# EAGLE design SparkFun_MIDI_Shield (EAGLE 7.3.0)
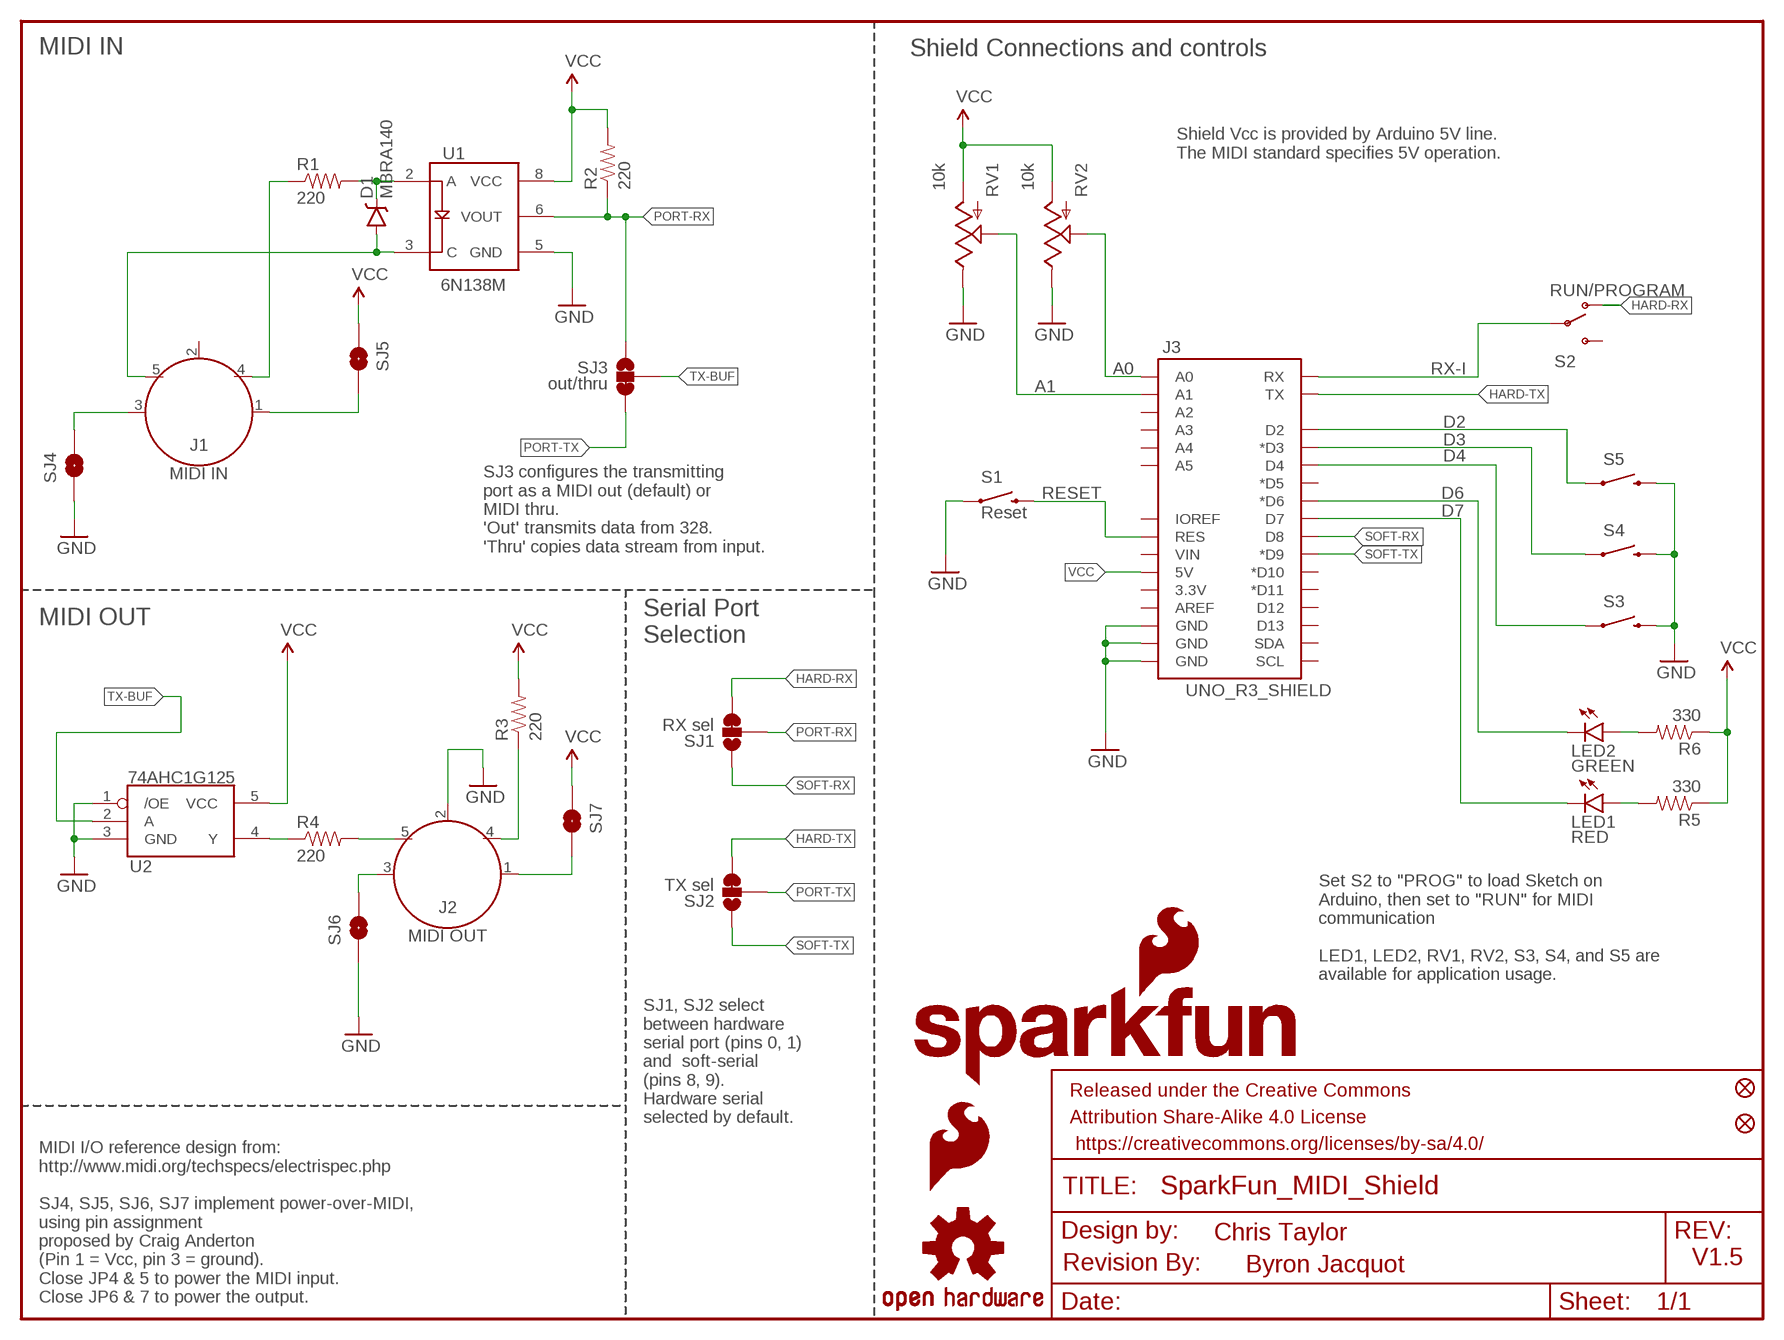
[diagram p0: schematic, sheet 1]

## Parts
D1  MBRA140  [SMA-DIODE]
FID1  FIDUCIALUFIDUCIAL  [MICRO-FIDUCIAL]
FID2  FIDUCIALUFIDUCIAL  [MICRO-FIDUCIAL]
FRAME1  Frame  FRAME-LETTER  [CREATIVE_COMMONS]
J1  MIDI IN  5-PIN-CIRCULAR-DINNEW  [5-PIN-DIN-RA-PCB-NEW]
J2  MIDI OUT  5-PIN-CIRCULAR-DINNEW  [5-PIN-DIN-RA-PCB-NEW]
J3  UNO_R3_SHIELD  ARDUINO_R3_SHIELD  [UNO_R3_SHIELD]
LED1  RED  LED-RED0603  [LED-0603]
LED2  GREEN  LED-GREEN0603  [LED-0603]
LOGO1  SFE_LOGO_NAME_FLAME.2_INCH  [SFE_LOGO_NAME_FLAME_.2]
LOGO2  OSHW-LOGOS  [OSHW-LOGO-S]
LOGO3  OSHW-LOGOM  [OSHW-LOGO-M]
LOGO5  SFE_LOGO_FLAME.1_INCH  [SFE_LOGO_FLAME_.1]
R1  220  220OHM-1/10W-1%(0603)  [0603-RES]
R2  220  220OHM-1/10W-1%(0603)  [0603-RES]
R3  220  220OHM-1/10W-1%(0603)  [0603-RES]
R4  220  220OHM-1/10W-1%(0603)  [0603-RES]
R5  330  330OHM1/10W1%(0603)  [0603-RES]
R6  330  330OHM1/10W1%(0603)  [0603-RES]
RV1  10k  POT  [ALPS_POT]
RV2  10k  POT  [ALPS_POT]
S1  Reset  SWITCH-MOMENTARY-2SMD  [TACTILE-SWITCH-SMD]
S2  RUN/PROGRAM  SWITCH-SPDTSMD  [AYZ0202]
S3  SWITCH-MOMENTARY-212MM  [TACTILE-PTH-12MM]
S4  SWITCH-MOMENTARY-212MM  [TACTILE-PTH-12MM]
S5  SWITCH-MOMENTARY-212MM  [TACTILE-PTH-12MM]
SJ1  RX sel  JUMPER-PAD-3-2OF3_NC_BY_TRACE_SMALL  [PAD-JUMPER-3-2OF3_NC_BY_TRACE_YES_SILK_FULL_BOX]
SJ2  TX sel  JUMPER-PAD-3-2OF3_NC_BY_TRACE_SMALL  [PAD-JUMPER-3-2OF3_NC_BY_TRACE_YES_SILK_FULL_BOX]
SJ3  out/thru  JUMPER-PAD-3-2OF3_NC_BY_TRACE_SMALL  [PAD-JUMPER-3-2OF3_NC_BY_TRACE_YES_SILK_FULL_BOX]
SJ4  JUMPER-PAD-2-NOYES_SILK  [PAD-JUMPER-2-NO_YES_SILK]
SJ5  JUMPER-PAD-2-NOYES_SILK  [PAD-JUMPER-2-NO_YES_SILK]
SJ6  JUMPER-PAD-2-NOYES_SILK  [PAD-JUMPER-2-NO_YES_SILK]
SJ7  JUMPER-PAD-2-NOYES_SILK  [PAD-JUMPER-2-NO_YES_SILK]
U1  6N138M  OPTO_DARL_6N138S  [8-SMD]
U2  74AHC1G125  [SOT23-5]
U$1  REVISION  [REVISION]

## Nets
56: D1.C R1.2 U1.2(A)
1235: J2.4 R3.1
A0: J3.A0 RV2.P$2(S)
A1: J3.A1 RV1.P$2(S)
D2: J3.D2 S5.1
D3: J3.D3(*D3) S4.1
D4: J3.D4 S3.1
D6: J3.D6(*D6) LED2.C
D7: J3.D7 LED1.C
GND: J2.2 J3.GND@0(GND) J3.GND@1(GND) J3.GND@2(GND) RV1.P$1(E) RV2.P$1(E) S1.1 S3.3 S4.3 S5.3 SJ4.1 SJ6.1 U1.5(GND) U2.1(/OE) U2.3(GND)
HARD-RX: S2.1(O) SJ1.3
HARD-TX: J3.TX SJ2.3
N$1: J2.5 R4.2
N$2: J1.4 R1.1
N$3: R4.1 U2.4(Y)
N$4: J2.3 SJ6.2
N$5: J2.1 SJ7.2
N$6: J1.3 SJ4.2
N$7: J1.1 SJ5.2
N$9: LED1.A R5.2
N$10: LED2.A R6.2
PIN5: D1.A J1.5 U1.3(C)
PORT-RX: R2.1 SJ1.2 SJ3.1 U1.6(VOUT)
PORT-TX: SJ2.2 SJ3.3
RESET: J3.RES S1.3
RX-I: J3.RX S2.2(P)
SOFT-RX: J3.D8 SJ1.1
SOFT-TX: J3.D9(*D9) SJ2.1
TX-BUF: SJ3.2 U2.2(A)
VCC: J3.5V R2.2 R3.2 R5.1 R6.1 RV1.P$3(A) RV2.P$3(A) SJ5.1 SJ7.1 U1.8(VCC) U2.5(VCC)
Unconnected: J1.2 J3.3.3V J3.A2 J3.A3 J3.A4 J3.A5 J3.AREF J3.D5(*D5) J3.D10(*D10) J3.D11(*D11) J3.D12 J3.D13 J3.IOREF J3.SCL J3.SDA J3.VIN S2.3(S)

## Notes on the sheet
- MIDI IN | Shield Connections and controls
- Shield Vcc is provided by Arduino 5V line.  
  The MIDI standard specifies 5V operation.
- SJ3 configures the transmitting
  port as a MIDI out (default) or 
  MIDI thru.
  'Out' transmits data from 328.
  'Thru' copies data stream from input.
- MIDI OUT
- Serial Port
  Selection
- Set S2 to "PROG" to load Sketch on 
  Arduino, then set to "RUN" for MIDI 
  communication
  
  LED1, LED2, RV1, RV2, S3, S4, and S5 are 
  available for application usage.
- SJ1, SJ2 select 
  between hardware 
  serial port (pins 0, 1) 
  and  soft-serial 
  (pins 8, 9).  
  Hardware serial 
  selected by default.
- MIDI I/O reference design from:
  http://www.midi.org/techspecs/electrispec.php
  
  SJ4, SJ5, SJ6, SJ7 implement power-over-MIDI, 
  using pin assignment
  proposed by Craig Anderton 
  (Pin 1 = Vcc, pin 3 = ground).
  Close JP4 & 5 to power the MIDI input.
  Close JP6 & 7 to power the output.
- Chris Taylor
- V1.5
- Byron Jacquot

## Library data of the parts
D1 = SparkFun-DiscreteSemi:MBRA140: 40V, 1A Schottky rectifier SMA/DO-214AC package DIO-08053; PROD_ID: DIO-08053
FID1 FID2 = SparkFun-Aesthetics:FIDUCIAL: Fiducial Alignment Points Various fiducial points for machine vision alignment.
FRAME1 = SparkFun-Aesthetics:FRAME-LETTER: Schematic Frame Standard 8.5x11 US Letter frame
J1 J2 = Testing:5-PIN-CIRCULAR-DIN: 5-pin circular DIN connector. Fillsize variant is frequently used as a MIDI jack; PROD_ID: CONN-09481
J3 = SparkFun-Boards:ARDUINO_R3_SHIELD: Shield form compatible with the Arduino Uno R3.
LED1 = SparkFun-LED:LED-RED: Assorted Red LEDs LilyPad 1206- DIO-09912 1206- DIO-00809 0603- DIO-00819 "SMART" means more efficient and expensive; PROD_ID: DIO-00819
LED2 = SparkFun-LED:LED-GREEN: Various green LEDs Green LEDs used in SFE Production 0603- DIO-00821 LARGE- DIO-00862 LILYPAD- DIO-09910; PROD_ID: DIO-00821
LOGO1 = SparkFun-Aesthetics:SFE_LOGO_NAME_FLAME: SFE Logo, name and flame This is the SparkFun full logo. The logo on the schematic will always be the same size; the package variant is the height of the flame part of the logo. Default layer for the logo on the board is tSilk.
LOGO2 LOGO3 = SparkFun-Aesthetics:OSHW-LOGO: Open Source Hardware Logo This logo indicates the piece of hardware it is found on incorporates a OSHW license and/or adheres to the definition of open source hardware found here: http://freedomdefined.org/OSHW
LOGO5 = SparkFun-Aesthetics:SFE_LOGO_FLAME: SFE Logo, flame only This is the SparkFun flame logo. The logo on the schematic will always be the same size; the package variant is the height of the flame. Default layer for the logo on the board is tSilk.
R1-R4 = SparkFun-Resistors:220OHM-1/10W-1%(0603): RES-07861; PROD_ID: RES-07861
R5 R6 = SparkFun-Resistors:330OHM1/10W1%(0603): RES-00818; PROD_ID: RES-00818
RV1 RV2 = SparkFun-Electromechanical:POT; PROD_ID: RES-09177
S1 = SparkFun-Electromechanical:SWITCH-MOMENTARY-2: Various NO switches- pushbuttons, reed, etc; PROD_ID: SWCH-08247
S2 = SparkFun-Electromechanical:SWITCH-SPDT: SPDT Switch Simple slide switch, Spark Fun Electronics SKU : COM-00102 DPDT SMT slide switch, AYZ0202, SWCH-08179; PROD_ID: SWCH-08179
S3-S5 = SparkFun-Electromechanical:SWITCH-MOMENTARY-2: Various NO switches- pushbuttons, reed, etc; PROD_ID: SWCH-09185
SJ1-SJ3 = SparkFun-Passives:JUMPER-PAD-3-2OF3_NC_BY_TRACE
SJ4-SJ7 = SparkFun-Passives:JUMPER-PAD-2-NO
U1 = SparkFun-DiscreteSemi:OPTO_DARL_6N138S: Optoisolator, darlington pair output; PROD_ID: IC-09482
U2 = SparkFun-DigitalIC:74AHC1G125: Single bus buffer gate with 3-state output; PROD_ID: IC-11920
U$1 = SparkFun-Aesthetics:REVISION

## Board
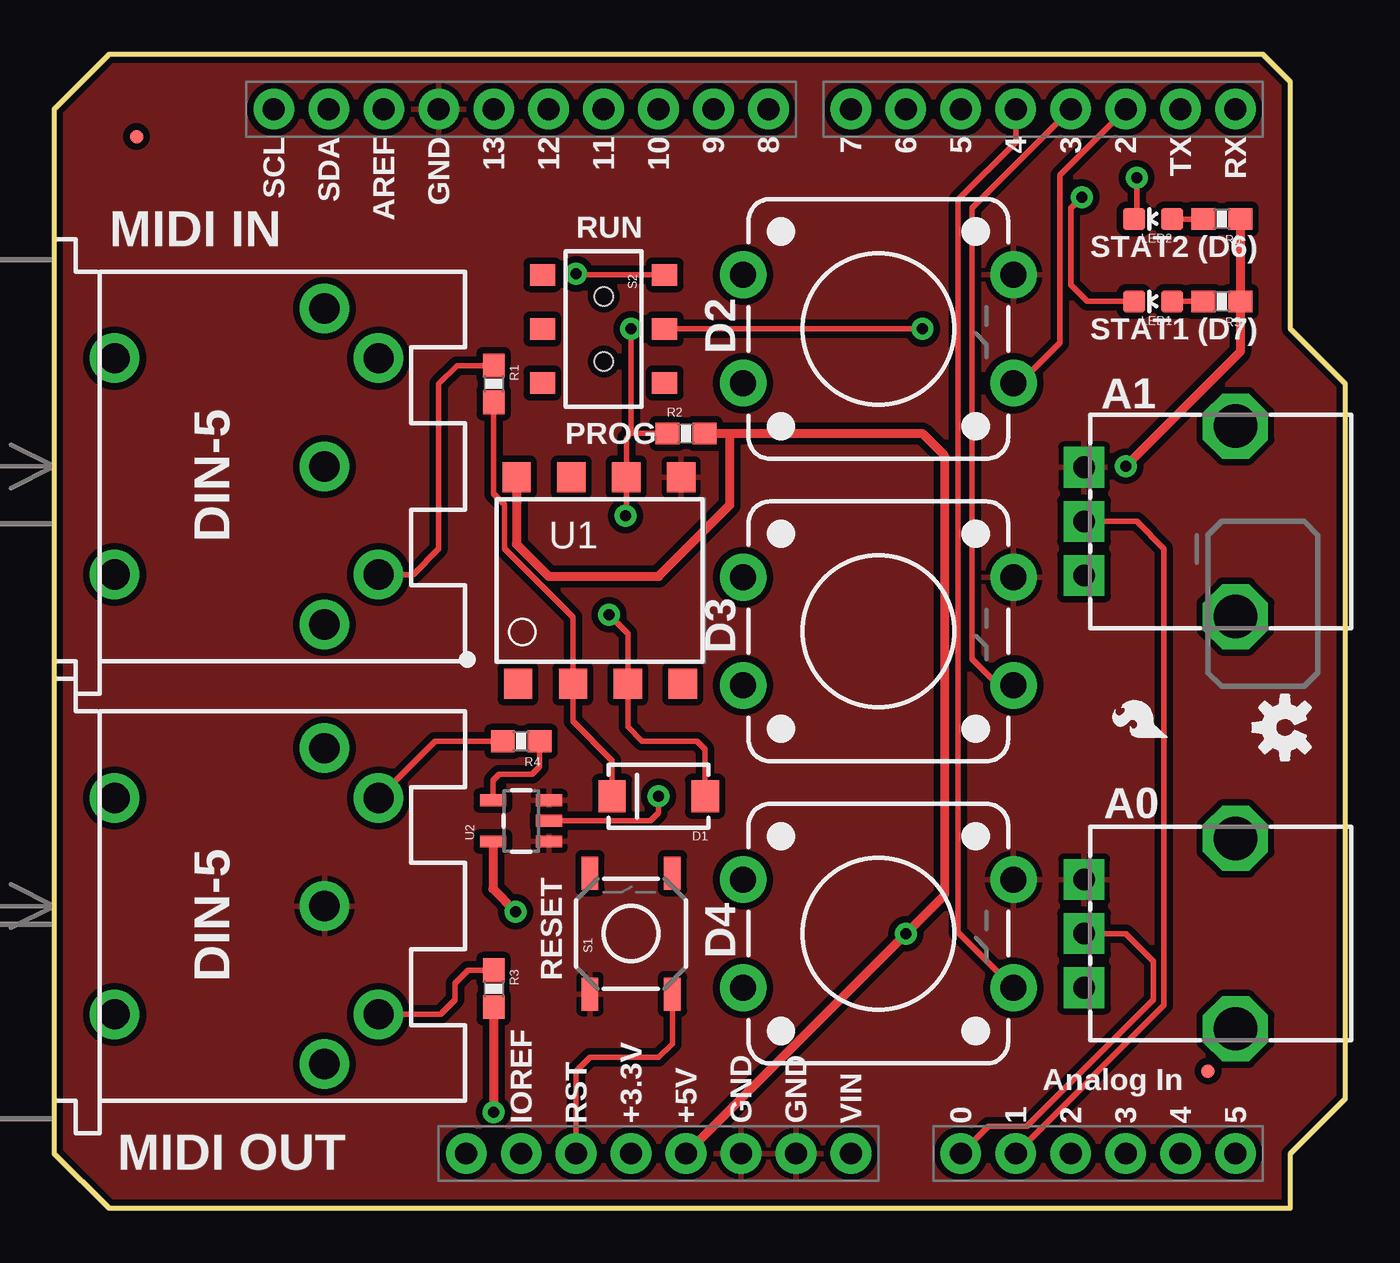
[diagram p1: board, top side]
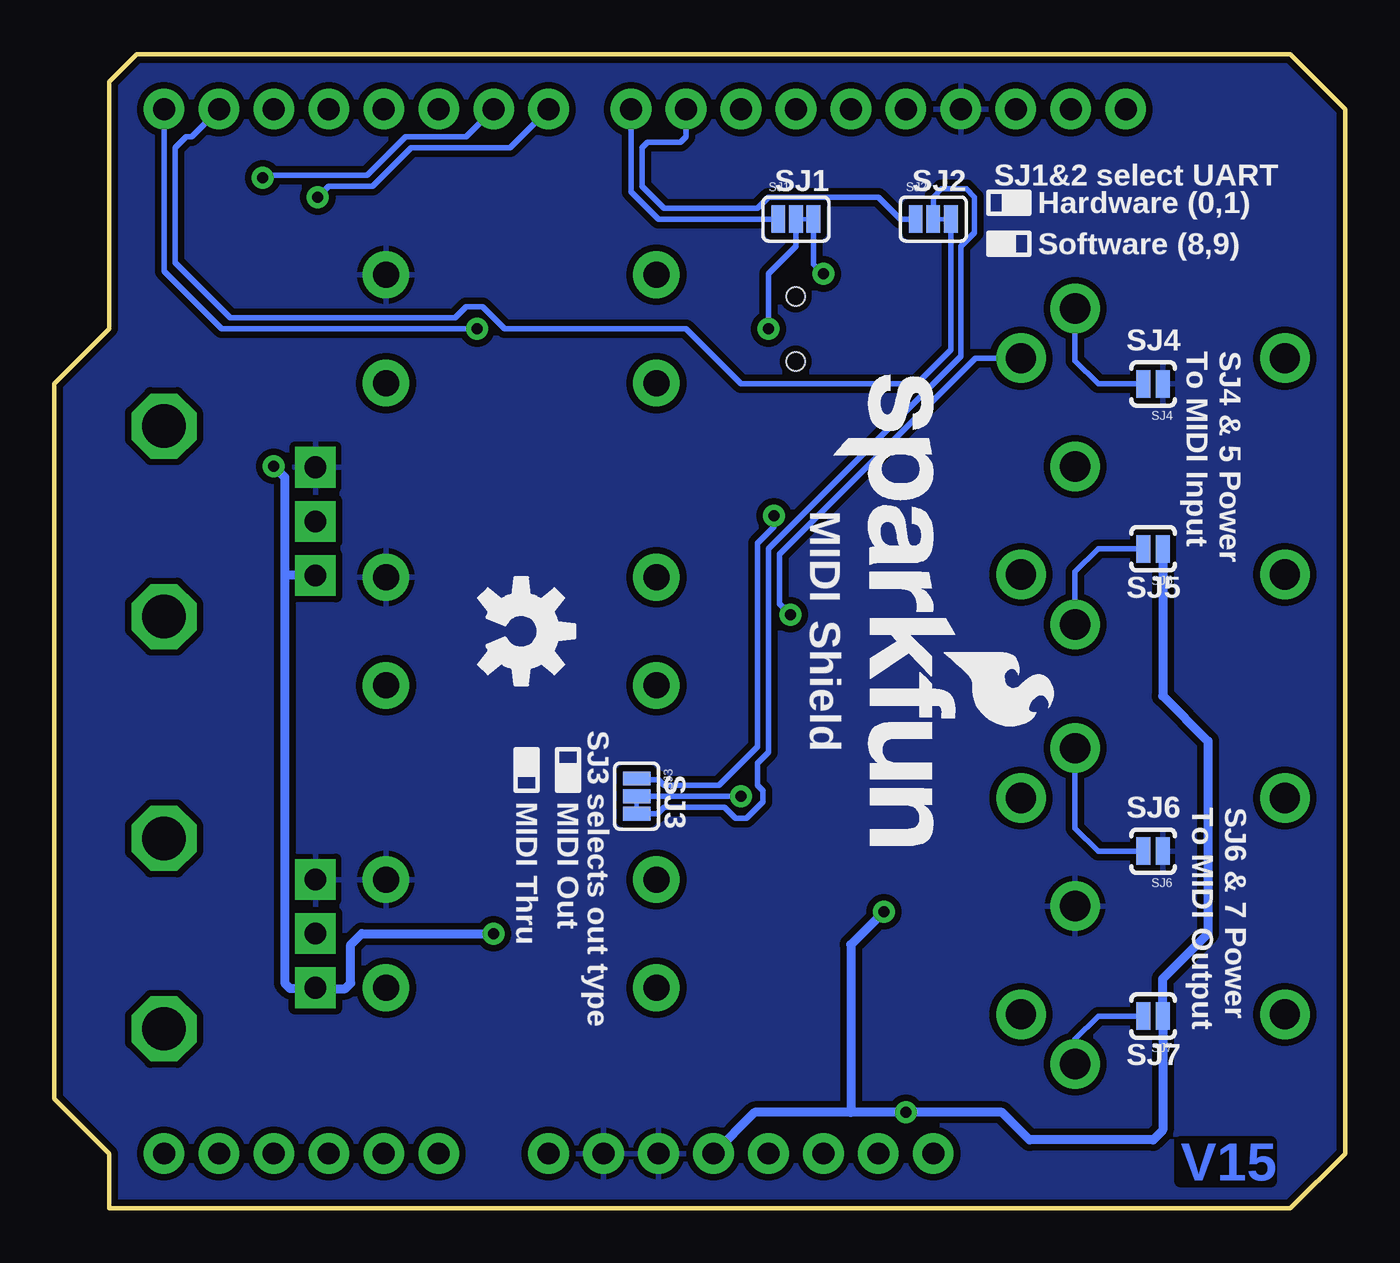
[diagram p2: board, bottom side, seen from below]

Size 59.69 x 53.34 mm. Coordinates in mm from the lower left corner, seen from the top.
Outline: 0,2.54 0,50.8 2.54,53.34 55.88,53.34 57.15,52.07 57.15,40.64 59.69,38.1 59.69,5.08 57.15,2.54 57.15,0 2.54,0 0,2.54
Copper layers (1+2*16): Top 0.035mm / dielectric 1.5mm / Route2 0.035mm / dielectric 0.15mm / Bottom 0.035mm
Design rules "SparkFun-2-layer *": minimum track width 7mil, minimum drill 15mil, track to track 8mil, track to pad 8mil, pad to pad 8mil, via to via 8mil, smd to smd 8mil, copper to edge 8mil, drill to drill 8mil, minimum pad ring 12mil, minimum via ring 10mil, stop-mask expansion 4mil, vias tented up to drill 20mil, thermal gap 10mil

### Footprints (pad centres in the part's own frame; a part is rotated, then mirrored left to right if it is on the bottom)
SMA-DIODE = smd 1.27 x 1.47: A -2.15,0; C 2.15,0
MICRO-FIDUCIAL = smd 0.635 x 0.635: 1 0,0
5-PIN-DIN-RA-PCB-NEW = drill 1.4 pad 2.286: 1 7.3,12.5; 2 0,12.5; 3 -7.3,12.5; 4 5,15; 5 -5,15; 6 -5,2.8; 7 5,2.8
UNO_R3_SHIELD = drill 1.016 pad 1.88: 3.3V 50.8,26.67; 5V 50.8,29.21; A0 50.8,41.91; A1 50.8,44.45; A2 50.8,46.99; A3 50.8,49.53; A4 50.8,52.07; A5 50.8,54.61; AREF 2.54,15.24; D2 2.54,49.53; D3 2.54,46.99; D4 2.54,44.45; D5 2.54,41.91; D6 2.54,39.37; D7 2.54,36.83; D8 2.54,33.02; D9 2.54,30.48; D10 2.54,27.94; D11 2.54,25.4; D12 2.54,22.86; D13 2.54,20.32; GND@0 50.8,31.75; GND@1 50.8,34.29; GND@2 2.54,17.78; IOREF 50.8,21.59; NC 50.8,19.05; RES 50.8,24.13; RX 2.54,54.61; SCL 2.54,10.16; SDA 2.54,12.7; TX 2.54,52.07; VIN 50.8,36.83
LED-0603 = smd 1 x 1: A 0,-0.877; C 0,0.877
0603-RES = smd 1.1 x 1: 1 -0.85,0; 2 0.85,0
ALPS_POT = drill 1 pad 1.88 square: P$1 7,-2.5; P$2 7,0; P$3 7,2.5 | drill 2 octagon: P$4 0,-4.4; P$5 0,4.4
TACTILE-SWITCH-SMD = smd 1.524 x 0.762: 1 -2.794,1.905; 2 2.794,1.905; 3 -2.794,-1.905; 4 2.794,-1.905
AYZ0202 = smd 1 x 1.15: 1 -2.5,2.825; 2 0,2.825; 3 2.5,2.825; 4 -2.5,-2.825; 5 0,-2.825; 6 2.5,-2.825 | hole 0.85: 1.5,0; -1.5,0
TACTILE-PTH-12MM = drill 1.2 pad 2.159: 1 6.25,-2.5; 2 -6.25,-2.5; 3 6.25,2.5; 4 -6.25,2.5
PAD-JUMPER-3-2OF3_NC_BY_TRACE_YES_SILK_FULL_BOX = smd 0.635 x 1.27: 1 -0.813,0; 2 0,0; 3 0.813,0
PAD-JUMPER-2-NO_YES_SILK = smd 0.635 x 1.27: 1 -0.45,0; 2 0.45,0
8-SMD = smd 1.3 x 1.4: 1 -3.96,-4.96; 2 -1.42,-4.96; 3 1.12,-4.96; 4 3.66,-4.96; 5 3.59,4.58; 6 1.05,4.58; 7 -1.49,4.58; 8 -4.03,4.58
SOT23-5 = smd 0.55 x 1.2: 1 -0.95,-1.3; 2 0,-1.3; 3 0.95,-1.3; 4 0.95,1.3; 5 -0.95,1.3

### Placement (x,y rotation side)
D1  27.94,19.05 180 top
FID1  53.34,6.35 0 top
FID2  3.81,49.53 0 top
FRAME1  -12.7,-13.97 0 top  (outside the outline)
J1  0,34.29 270 top
J2  0,13.97 270 top
J3  0,53.34 270 top
LED1  50.8,41.91 90 top
LED2  50.8,45.72 90 top
LOGO1  23.75,39.24 270 bottom
LOGO2  56.9,22.23 90 top
LOGO3  38.1,26.67 270 bottom
LOGO5  51.82,21.46 90 top
R1  20.32,38.1 270 top
R2  29.21,35.81 0 top
R3  20.32,10.16 270 top
R4  21.59,21.59 180 top
R5  53.98,41.91 180 top
R6  53.98,45.72 180 top
RV1  54.61,31.75 180 top
RV2  54.61,12.7 180 top
S1  26.67,12.7 90 top
S2  25.4,40.64 270 top
S3  38.1,12.7 0 top
S4  38.1,26.67 0 top
S5  38.1,40.64 0 top
SJ1  25.4,45.72 0 bottom
SJ2  19.05,45.72 0 bottom
SJ3  32.77,19.05 270 bottom
SJ4  8.89,38.1 180 bottom
SJ5  8.89,30.48 180 bottom
SJ6  8.89,16.51 180 bottom
SJ7  8.89,8.89 180 bottom
U1  25.4,29.21 0 top
U2  21.59,17.91 90 top
U$1  -1.27,-16.51 0 top  (outside the outline)

### Tracks (layer width: path | path; a pad name or v marks a point on that pad's centre or on a via)
56
  Top 0.254: D1.C 25.79,20.69 23.98,22.5 U1.2 23.98,27.33 20.83,30.48 20.83,32.51 20.32,33.02 R1.2
1235
  Top 0.254: J2.4 17.86,8.97 18.54,9.65 18.54,10.41 19.14,11.01 R3.1
A0
  Top 0.254: J3.A0 43.18,3.81 44.96,3.81 50.8,9.65 50.8,11.43 49.53,12.7 RV2.P$2
A1
  Top 0.254: J3.A1 51.31,9.4 51.31,30.48 50.04,31.75 RV1.P$2
D2
  Top 0.254: S5.1 44.62,38.14 46.48,40.01 46.48,47.75 J3.D2
D3
  Top 0.254: S4.1 43.65,24.17 42.42,25.4 42.42,46.23 J3.D3
D4
  Top 0.254: S3.1 41.78,12.77 41.78,46.61 44.45,49.28 J3.D4
D6  (via drill 0.51)
  Top 0.254: LED2.C 50.04,45.84 v50.04,47.62
  Bottom 0.254: J3.D6 40.64,49.53 43.43,49.53 45.21,47.75 50.04,47.75 v50.04,47.62
D7  (via drill 0.51)
  Top 0.254: v47.5,46.74 46.99,46.23 46.99,42.67 47.75,41.91 LED1.C
  Bottom 0.254: J3.D7 38.61,49.02 43.18,49.02 44.96,47.24 46.99,47.24 v47.5,46.74
GND
  pour Bottom (isolate 0.305): 0,50.8 2.54,53.34 55.88,53.34 57.15,52.07 57.15,40.64 59.69,38.1 59.69,5.08 57.15,2.54 57.15,0 2.54,0 0,2.54
  pour Top (isolate 0.305): 0,50.8 2.54,53.34 55.88,53.34 57.15,52.07 57.15,40.64 59.69,38.1 59.69,5.08 57.15,2.54 57.15,0 2.54,0 0,2.54
HARD-RX  (via drill 0.51)
  Top 0.254: S2.1 24.17,43.14 v24.13,43.18
  Bottom 0.254: SJ1.3 24.59,43.64 v24.13,43.18
HARD-TX
  Bottom 0.254: J3.TX 53.34,49.53 53.59,49.53 54.1,49.02 54.1,43.69 51.56,41.15 41.15,41.15 40.64,41.66 39.88,41.66 38.86,40.64 30.48,40.64 27.94,38.1 19.81,38.1 18.24,39.67 SJ2.3
N$1
  Top 0.254: R4.2 17.62,21.59 J2.5
N$2
  Top 0.254: J1.4 16.59,29.29 17.78,30.48 17.78,38.1 18.63,38.95 R1.1
N$3
  Top 0.254: U2.4 20.29,19.78 20.57,20.07 22.1,20.07 22.44,20.41 R4.1
N$4
  Bottom 0.254: SJ6.2 11.43,16.51 12.5,17.58 J2.3
N$5
  Bottom 0.254: SJ7.2 11.43,8.89 12.5,7.82 J2.1
N$6
  Bottom 0.254: SJ4.2 11.43,38.1 12.5,39.17 J1.3
N$7
  Bottom 0.254: SJ5.2 11.43,30.48 12.5,29.41 J1.1
N$9
  Top 0.254: LED1.A R5.2
N$10
  Top 0.254: LED2.A R6.2
PIN5  (via drill 0.51)
  Top 0.254: v25.65,27.43 26.52,26.57 U1.3 26.52,22.25 27.18,21.59 29.72,21.59 30.09,21.22 D1.A
  Bottom 0.254: v25.65,27.43 26.16,27.94 26.16,30.23 17.1,39.29 J1.5
PORT-RX  (via drill 0.51)
  Top 0.254: R2.1 26.67,35.81 | v26.67,40.64 26.67,35.81 | v26.42,32 26.45,32.04 U1.6 26.45,35.59 26.67,35.81
  Bottom 0.254: SJ1.2 25.4,44.45 26.67,43.18 v26.67,40.64 | SJ3.1 32.77,19.81 31.75,19.81 31.5,19.56 28.96,19.56 27.18,21.34 27.18,30.73 26.42,31.5 v26.42,32
PORT-TX
  Bottom 0.254: SJ2.2 19.05,46.74 18.67,47.12 17.53,47.12 17.14,46.74 17.14,45.09 17.78,44.45 17.78,39.37 26.67,30.48 26.67,21.08 27.18,20.57 27.18,19.56 26.92,19.3 26.92,18.8 27.69,18.03 28.19,18.03 28.7,18.54 31.5,18.54 31.8,18.24 SJ3.3
RESET
  Top 0.254: J3.RES 24.13,6.35 24.77,6.99 27.94,6.99 28.57,7.62 S1.3
RX-I  (via drill 0.51)
  Top 0.254: v40.13,40.64 S2.2
  Bottom 0.254: v40.13,40.64 51.94,40.64 54.61,43.31 J3.RX
SOFT-RX
  Bottom 0.254: J3.D8 33.02,46.99 31.75,45.72 SJ1.1
SOFT-TX
  Bottom 0.254: J3.D9 30.48,49.53 30.73,49.28 32.26,49.28 32.51,49.02 32.51,47.24 31.5,46.23 27.43,46.23 27.18,46.23 26.67,46.74 21.59,46.74 20.57,45.72 SJ2.1
TX-BUF  (via drill 0.51)
  Top 0.254: U2.2 27.56,17.91 27.94,18.29 v27.94,19.05
  Bottom 0.254: v27.94,19.05 SJ3.2
VCC  (via drill 0.51)
  Top 0.406: R6.1 R5.1 54.83,39.59 v49.53,34.29 | J3.5V v39.37,12.7 41.15,14.48 41.15,34.8 40.13,35.81 31.24,35.81 | R2.2 31.24,35.81 | U1.8 21.37,30.7 22.86,29.21 27.94,29.21 31.24,32.51 31.24,35.81 | U2.5 20.29,14.76 v21.34,13.72 | R3.2 v20.32,4.45
  Bottom 0.406: 22.86,4.45 v20.32,4.45 15.88,4.45 14.61,3.17 8.89,3.17 8.44,3.62 SJ7.1 8.44,10.61 6.35,12.7 6.35,21.59 8.44,23.68 SJ5.1 | 22.86,4.45 27.3,4.45 J3.5V | 22.86,4.45 22.86,12.19 v21.34,13.72 | v49.53,34.29 49.02,33.78 49.02,29.21 | 49.02,29.21 49.02,10.41 48.77,10.16 47.65,10.16 RV2.P$3 47.57,10.16 46.23,10.16 45.97,10.41 45.97,12.19 45.47,12.7 v39.37,12.7 | RV1.P$3 48.98,29.25 49.02,29.21

### Text on the board
Bottom: V15
tPlace: RUN | MIDI IN | STAT2 (D6) | STAT1 (D7) | D2 | A1 | PROG | D3 | A0 | D4 | RESET | MIDI OUT
bPlace: SJ1&2 select UART | SJ2 | SJ1 | Hardware (0,1) | Software (8,9) | SJ4 | SJ4 & 5 Power / To MIDI Input | MIDI | SJ5 | Shield | SJ3 selects out type | SJ6 & 7 Power / To MIDI Output | SJ6 | SJ3 | MIDI Out | MIDI Thru | SJ7
Measures: 5-pin DIN connectors need approx / 0.53" (13.5mm) diam holes | Pot shafts are 0.24" (6mm) diameter | All units in Inches
tDocu: Chris Taylor | Byron Jacquot